# EAGLE design spi_flasher (EAGLE 9.2.1)
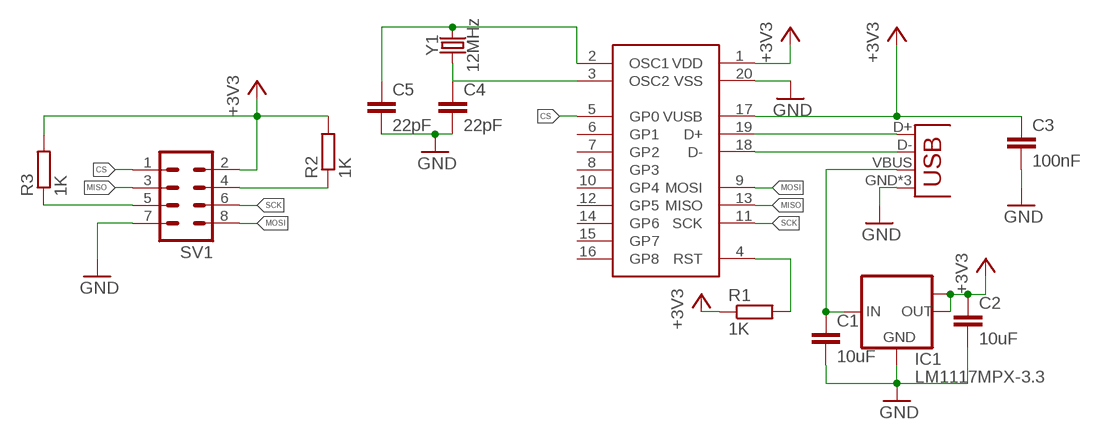
[diagram p0: schematic, sheet 1]

## Parts
C1  10uF  C-EUC1206  [C1206]
C2  10uF  C-EUC1206  [C1206]
C3  100nF  C-EUC0603  [C0603]
C4  22pF  C-EUC0603  [C0603]
C5  22pF  C-EUC0603  [C0603]
IC1  LM1117MPX-3.3  [SOT223]
R1  1K  R-EU_R0603  [R0603]
R2  1K  R-EU_R0603  [R0603]
R3  1K  R-EU_R0603  [R0603]
SV1  MA04-2  [MA04-2]
U$1  MCP2210-I/SO  [SO20L]
X1  USBPTH  [USB-B-PTH]
Y1  12MHz  CRYSTALSMD-3.2X2.5  [CRYSTAL-SMD-3.2X2.5MM]

## Nets
+3V3: C2.1 C3.1 IC1.2(OUT) IC1.TAB(OUT1) R1.1 R2.2 R3.2 SV1.2 U$1.1(VDD) U$1.17(VUSB)
CS: SV1.1 U$1.5(GP0)
GND: C1.2 C2.2 C3.2 C4.2 C5.2 IC1.1(GND) SV1.7 U$1.20(VSS) X1.GND X1.P$1(GND) X1.P$2(GND)
MISO: SV1.3 U$1.13(MISO)
MOSI: SV1.8 U$1.9(MOSI)
N$1: U$1.19(D+) X1.D+
N$2: U$1.18(D-) X1.D-
N$3: C4.1 U$1.3(OSC2) Y1.1
N$4: C1.1 IC1.3(IN) X1.VBUS
N$5: C5.1 U$1.2(OSC1) Y1.3
N$6: R1.2 U$1.4(RST)
N$11: R3.1 SV1.5
N$15: R2.1 SV1.4
SCK: SV1.6 U$1.11(SCK)
Unconnected: U$1.6(GP1) U$1.7(GP2) U$1.8(GP3) U$1.10(GP4) U$1.12(GP5) U$1.14(GP6) U$1.15(GP7) U$1.16(GP8)

## Library data of the parts
C1-C5 = rcl:C-EU: CAPACITOR, European symbol; SPICEPREFIX: C
IC1 = lm1117:LM1117MPX-*
R1-R3 = rcl:R-EU_: RESISTOR, European symbol; SPICEPREFIX: R
SV1 = con-lstb:MA04-2: PIN HEADER; OC_FARNELL: unknown; OC_NEWARK: unknown
U$1 = mcp2210:MCP2210-I/SO: Microchip MCP2210 with a SO20L package.
X1 = usb:USB: USB Connectors USB-B-PTH is fully proven SKU : PRT-00139 USB-miniB is fully proven SKU : PRT-00587 USB-A-PCB is untested. USB-A-H is throughly reviewed, but untested. Spark Fun Electronics SKU : PRT-00437 USB-B-SMT is throughly reviewed, but untested. Needs silkscreen touching up. USB-A-S has not been used/tested USB-MB-H has not been used/tested
Y1 = SparkFun-Clocks:CRYSTAL: Crystals (Generic) These are passive quartz crystals, which can be used as a clock source for a microcontroller. Crystal's are two-terminal devices. They require external "load" capacitors to generate an oscillating signal.

## Board
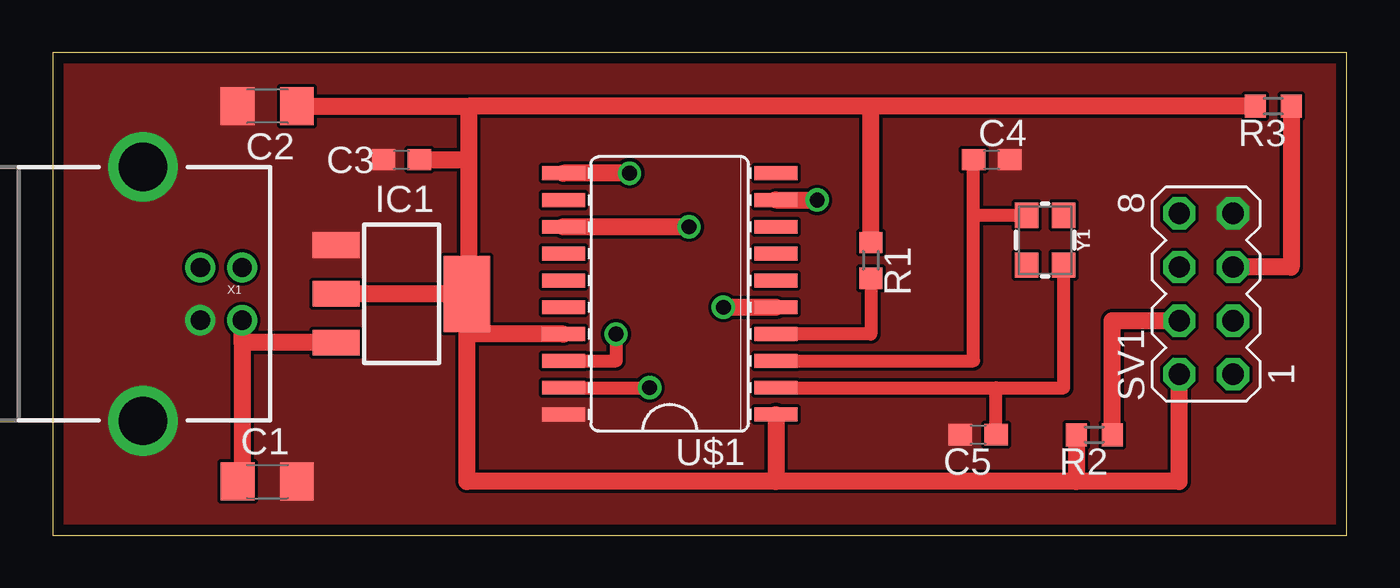
[diagram p1: board, top side]
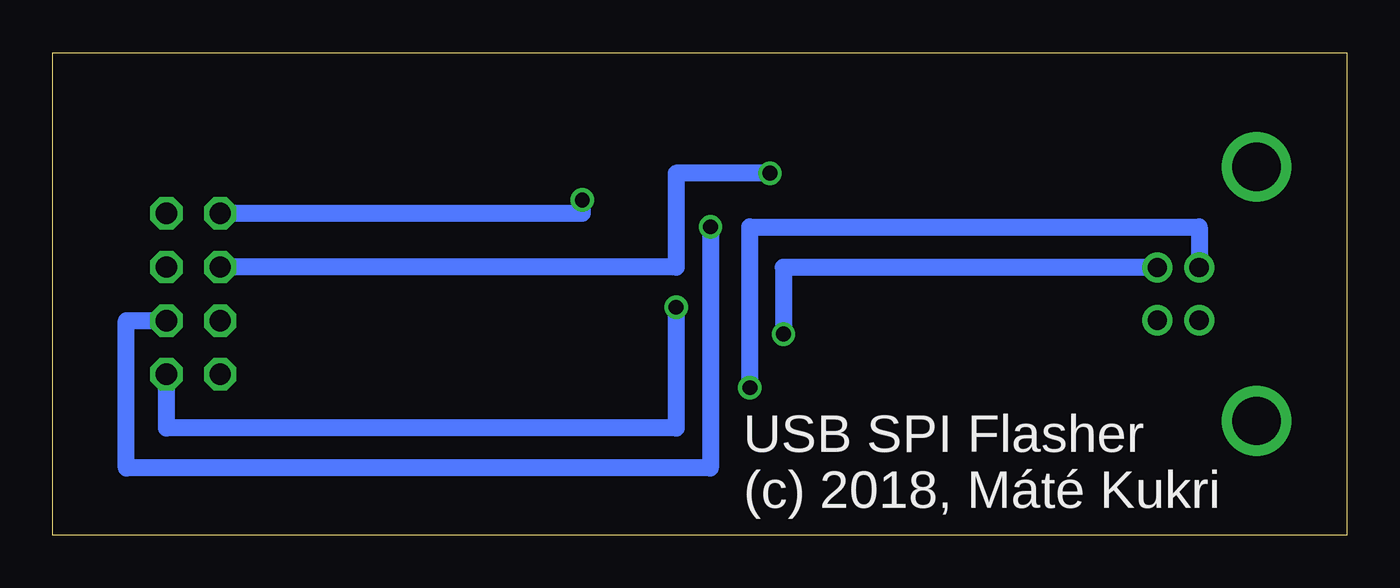
[diagram p2: board, bottom side, seen from below]

Size 61.27 x 22.85 mm. Coordinates in mm from the lower left corner, seen from the top.
Outline: 0,0 61.27,0 61.27,22.85 0,22.85 0,0
Copper layers (1*16): Top 0.035mm / dielectric 1.5mm / Bottom 0.035mm
Design rules "default *": minimum track width 6mil, minimum drill 0.35mm, track to track 6mil, track to pad 6mil, pad to pad 6mil, via to via 6mil, smd to smd 6mil, copper to edge 20mil, drill to drill 6mil, minimum pad ring 10mil, minimum via ring 8mil, stop-mask expansion 4mil, vias tented up to drill 0mil, thermal gap 10mil

### Footprints (pad centres in the part's own frame; a part is rotated, then mirrored left to right if it is on the bottom)
C1206 = smd 1.6 x 1.8: 1 -1.4,0; 2 1.4,0
C0603 = smd 1.1 x 1: 1 -0.85,0; 2 0.85,0
SOT223 = smd 1.219 x 2.235: 1 -2.311,-3.099; 2 0,-3.099; 3 2.311,-3.099 | smd 3.6 x 2.2: TAB 0,3.099
R0603 = smd 1 x 1.1: 1 -0.85,0; 2 0.85,0
MA04-2 = drill 1.016 octagon: 1 -3.81,-1.27; 2 -3.81,1.27; 3 -1.27,-1.27; 4 -1.27,1.27; 5 1.27,-1.27; 6 1.27,1.27; 7 3.81,-1.27; 8 3.81,1.27
SO20L = smd 0.66 x 2.032: 1 -5.715,-5.029; 2 -4.445,-5.029; 3 -3.175,-5.029; 4 -1.905,-5.029; 5 -0.635,-5.029; 6 0.635,-5.029; 7 1.905,-5.029; 8 3.175,-5.029; 9 4.445,-5.029; 10 5.715,-5.029; 11 5.715,5.029; 12 4.445,5.029; 13 3.175,5.029; 14 1.905,5.029; 15 0.635,5.029; 16 -0.635,5.029; 17 -1.905,5.029; 18 -3.175,5.029; 19 -4.445,5.029; 20 -5.715,5.029
USB-B-PTH = drill 0.914: D+ 0,1.25; D- 1.981,1.25; GND 0,-1.25; VBUS 1.981,-1.25 | drill 2.286: P$1 -2.718,-6.02; P$2 -2.718,6.02
CRYSTAL-SMD-3.2X2.5MM = smd 1.2 x 1.1: 1 -1.175,-0.875; 2 1.175,-0.875; 3 1.175,0.875; 4 -1.175,0.875

### Placement (x,y rotation side)
C1  10.16,2.54 0 top
C2  10.16,20.32 180 top
C3  16.51,17.78 180 top
C4  44.45,17.78 0 top
C5  43.81,4.76 180 top
IC1  16.51,11.43 270 top
R1  38.73,13.02 270 top
R2  49.31,4.75 180 top
R3  57.78,20.32 180 top
SV1  54.61,11.43 90 top
U$1  29.21,11.43 90 top
X1  6.99,11.43 0 top
Y1  46.99,13.97 270 top

### Tracks (layer width: path | path; a pad name or v marks a point on that pad's centre or on a via)
+3V3
  Top 0.813: 19.61,9.53 19.61,2.54 34.24,2.54 | 19.61,9.53 IC1.TAB | 48.46,2.54 53.34,2.54 SV1.2 | 48.46,2.54 34.24,2.54 | C2.1 19.68,20.32 | 19.68,20.32 19.68,17.78 | 19.68,17.78 19.68,11.43 IC1.TAB | IC1.TAB IC1.2 | U$1.1 34.24,2.54 | C3.1 19.68,17.78 | U$1.17 19.61,9.53 | R1.1 38.73,20.32 | 38.73,20.32 19.68,20.32 | R3.2 38.73,20.32 | R2.2 48.46,2.54
CS  (via drill 0.7)
  Top 0.813: U$1.5 v31.75,10.79
  Bottom 0.813: SV1.1 55.88,5.08 31.75,5.08 v31.75,10.79
GND
  pour Top (no thermals): -0.64,23.5 62.23,23.5 62.23,-0.64 -0.64,-0.64
MISO  (via drill 0.7)
  Top 0.813: v30.13,14.61 U$1.13
  Bottom 0.813: v30.13,14.61 30.13,3.17 57.78,3.17 57.78,10.16 SV1.3
MOSI  (via drill 0.7)
  Top 0.813: U$1.9 v36.2,15.88
  Bottom 0.813: v36.2,15.88 36.2,15.24 SV1.8
N$1  (via drill 0.7)
  Top 0.61: U$1.19 v28.26,6.98
  Bottom 0.813: v28.26,6.98 28.26,14.61 6.99,14.61 X1.D+
N$2  (via drill 0.7)
  Top 0.61: v26.67,9.53 26.67,8.26 U$1.18
  Bottom 0.813: X1.D- 26.67,12.68 v26.67,9.53
N$3
  Top 0.61: Y1.1 43.6,15.14 | 43.6,15.14 C4.1 | U$1.3 43.6,8.26 43.6,15.14
N$4
  Top 0.813: IC1.3 8.97,9.12 | 8.97,9.12 8.97,2.54 | 8.97,9.12 X1.VBUS | X1.VBUS
  Top 1.016: 8.97,2.54 C1.1
N$5
  Top 0.61: U$1.2 44.66,6.98 | C5.1 44.66,6.98 | 44.66,6.98 47.87,6.98 Y1.3
N$6
  Top 0.61: R1.2 38.73,9.53 U$1.4
N$11
  Top 0.813: R3.1 58.63,12.7 SV1.5
N$15
  Top 0.813: R2.1 50.16,10.16 SV1.4
SCK  (via drill 0.7)
  Top 0.813: v27.3,17.15 U$1.11
  Bottom 0.813: v27.3,17.15 31.75,17.15 31.75,12.7 SV1.6

### Text on the board
bPlace: USB SPI Flasher / (c) 2018, Máté Kukri